# Altium schematic sheet Sheet1.SchDoc
size A3
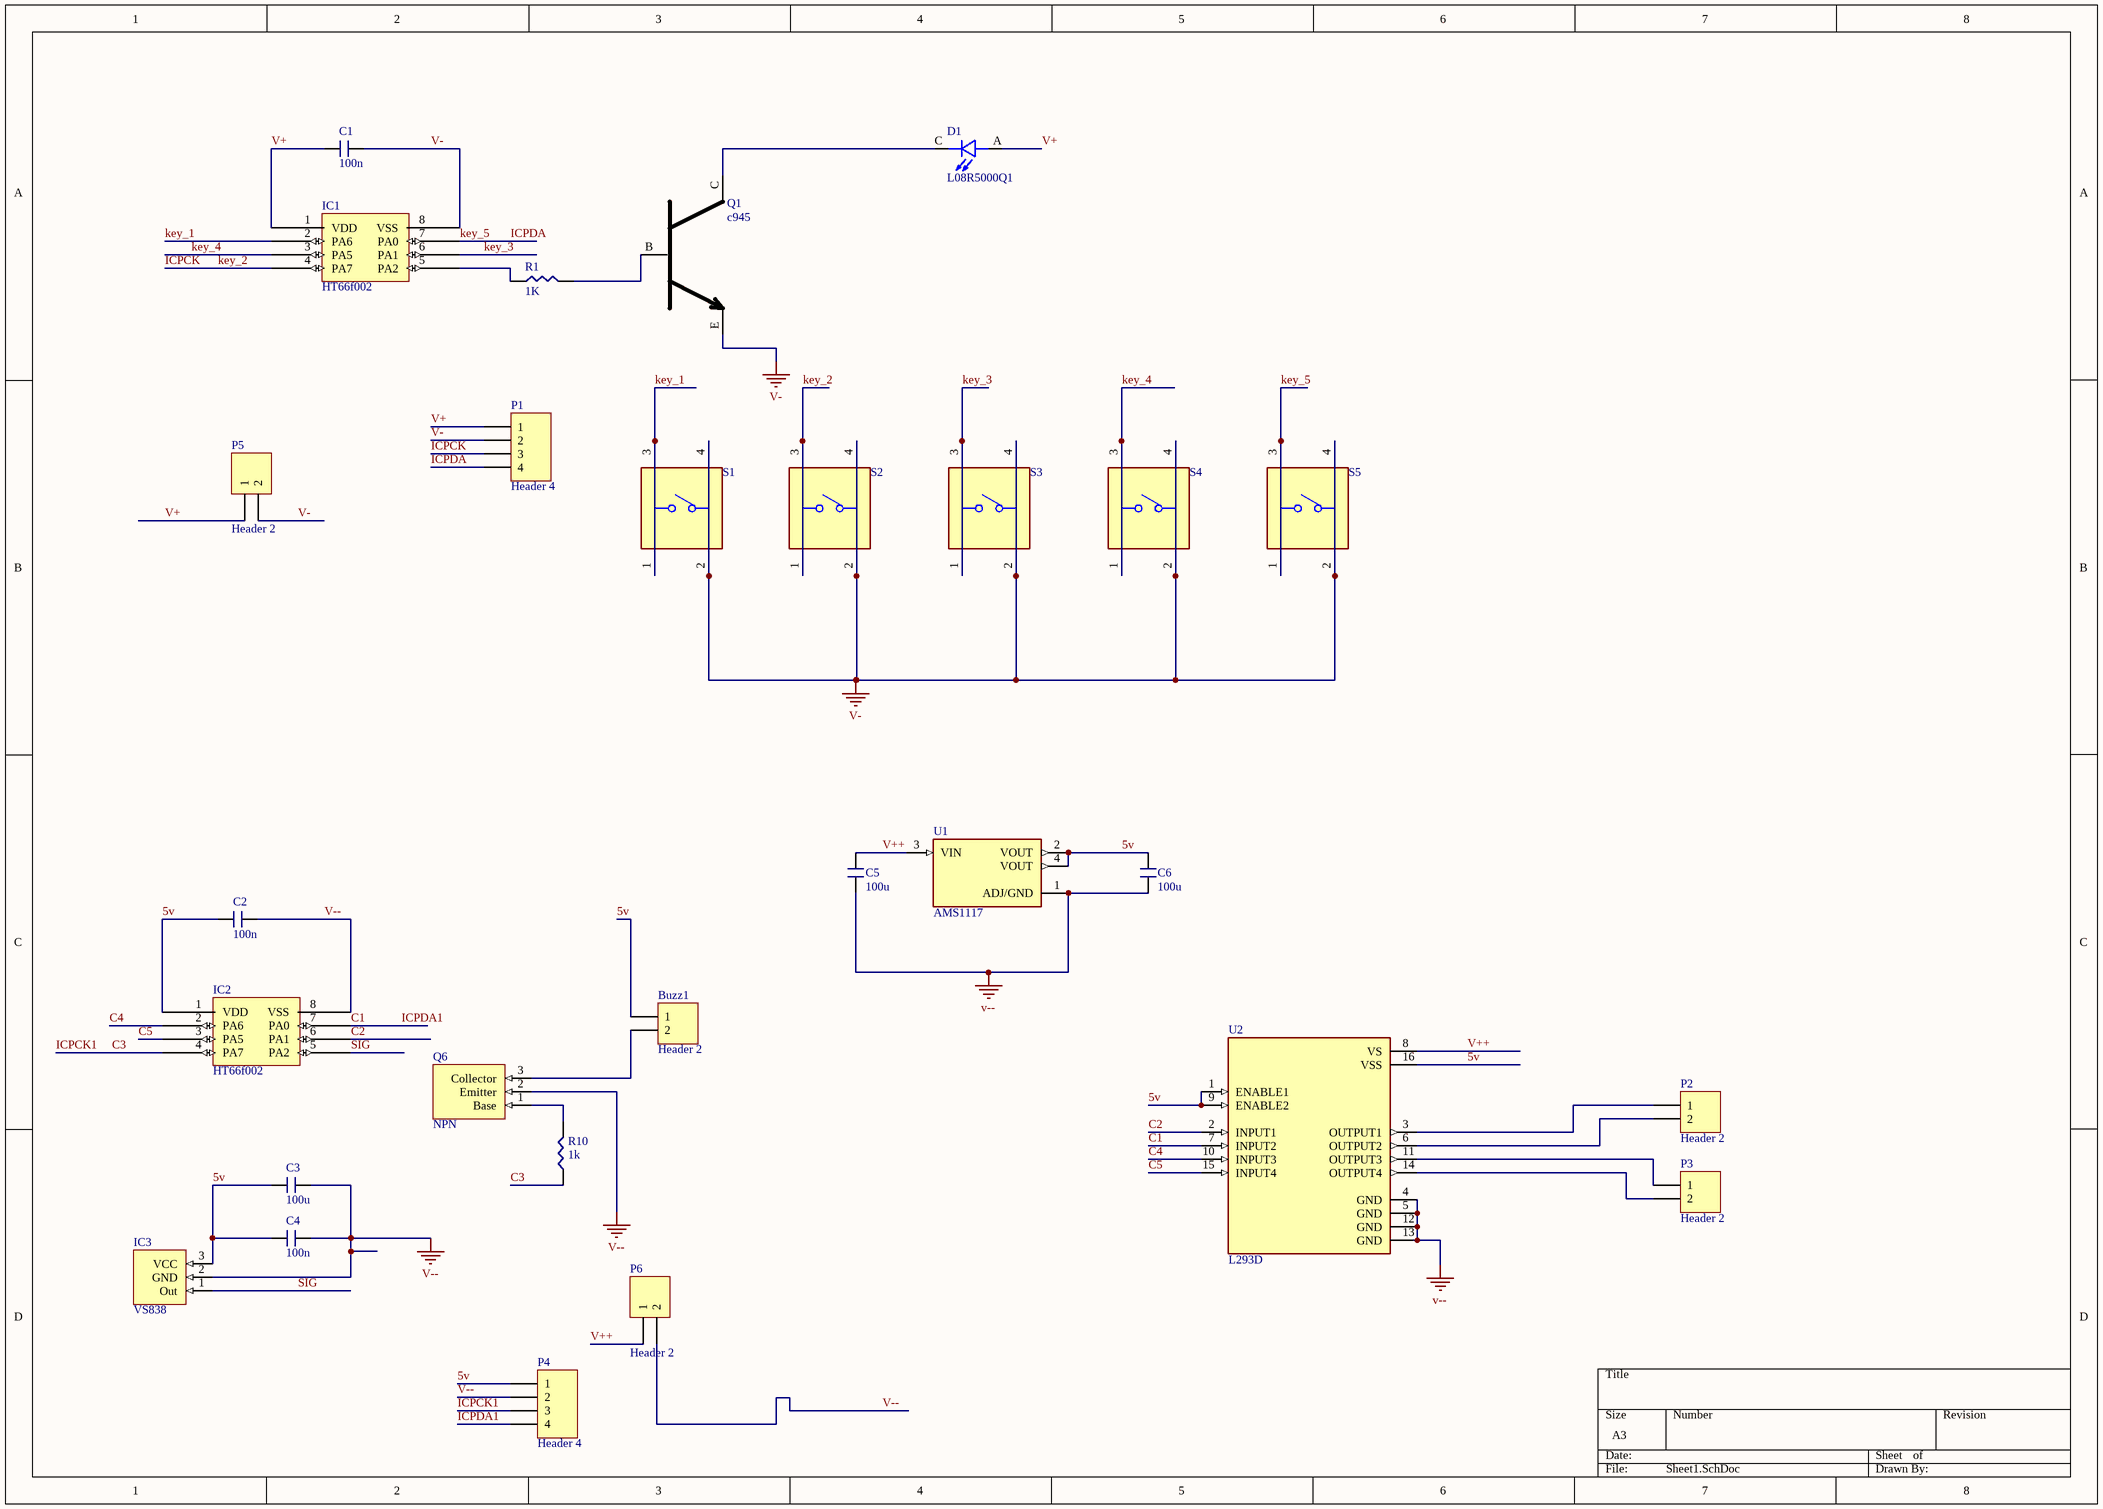
[diagram p0: Sheet1.SchDoc]

## Parts
Buzz1  Header 2  [HDR1X2]
C1  value 100n  [CAPC2012X08N-805]  (hidden comment: Capacitor)
C2  value 100n  [CAPC2012X08N-805]  (hidden comment: Capacitor)
C3  value 100u  [CAPC2012X08N-805]  (hidden comment: Capacitor)
C4  value 100n  [CAPC2012X08N-805]  (hidden comment: Capacitor)
C5  value 100u  [CAPC2012X08N-805]  (hidden comment: Capacitor)
C6  value 100u  [CAPC2012X08N-805]  (hidden comment: Capacitor)
D1  L08R5000Q1  [LEDRD254W57D500H1070]
IC1  HT66f002  [ht66f002]
IC2  HT66f002  [ht66f002]
IC3  VS838  [VS838]
P1  Header 4  [HDR1X4]
P2  Header 2  [HDR1X2]
P3  Header 2  [HDR1X2]
P4  Header 4  [HDR1X4]
P5  Header 2  [HDR1X2]
P6  Header 2  [HDR1X2]
Q1  c945  [c945]
Q6  NPN  [MMBT8050]
R1  value 1K  [RESC2012X06N-805]  (hidden comment: Resistor)
R10  value 1k  [RESC2012X06N-805]  (hidden comment: Resistor)
S1  TS04-66-95-BK-100-SMT  [SW_TS04-66-95-BK-100-SMT]  (value not drawn)
S2  TS04-66-95-BK-100-SMT  [SW_TS04-66-95-BK-100-SMT]  (value not drawn)
S3  TS04-66-95-BK-100-SMT  [SW_TS04-66-95-BK-100-SMT]  (value not drawn)
S4  TS04-66-95-BK-100-SMT  [SW_TS04-66-95-BK-100-SMT]  (value not drawn)
S5  TS04-66-95-BK-100-SMT  [SW_TS04-66-95-BK-100-SMT]  (value not drawn)
U1  AMS1117  [SOT229P700X180-4N]
U2  L293D  [DIP880W50P254L2000H510Q16]

## Nets
V-: C1.2 IC1.8(VSS) P1.2 P5.2 Q1.E S1.2 S1.4 S2.2 S2.4 S3.2 S3.4 S4.2 S4.4 S5.2 S5.4
V--: C2.2 C3.2 C4.2 C5.1 C6.1 IC2.8(VSS) IC3.2(GND) P4.2 P6.2 Q6.2(Emitter) U1.1(ADJ/GND) U2.4(GND) U2.5(GND) U2.12(GND) U2.13(GND)
5v: Buzz1.1 C2.1 C3.1 C4.1 C6.2 IC2.1(VDD) IC3.3(VCC) P4.1 U1.2(VOUT) U1.4(VOUT) U2.1(ENABLE1) U2.9(ENABLE2) U2.16(VSS)
C1: IC2.7(PA0) P4.4 U2.7(INPUT2)  [also labelled ICPDA1]
C2: IC2.6(PA1) U2.2(INPUT1)
C3: IC2.4(PA7) P4.3 R10.1  [also labelled ICPCK1]
C4: IC2.2(PA6) U2.10(INPUT3)
C5: IC2.3(PA5) U2.15(INPUT4)
ICPCK: IC1.4(PA7) P1.3 S2.1 S2.3  [also labelled key_2]
ICPDA: IC1.7(PA0) P1.4 S5.1 S5.3  [also labelled key_5]
key_1: IC1.2(PA6) S1.1 S1.3
key_3: IC1.6(PA1) S3.1 S3.3
key_4: IC1.3(PA5) S4.1 S4.3
SIG: IC2.5(PA2) IC3.1(Out)
V+: C1.1 D1.A IC1.1(VDD) P1.1 P5.1
V++: C5.2 P6.1 U1.3(VIN) U2.8(VS)
NetBuzz1_2: Buzz1.2 Q6.3(Collector)
NetD1_C: D1.C Q1.C
NetIC1_5: IC1.5(PA2) R1.1
NetP2_1: P2.1 U2.3(OUTPUT1)
NetP2_2: P2.2 U2.6(OUTPUT2)
NetP3_1: P3.1 U2.11(OUTPUT3)
NetP3_2: P3.2 U2.14(OUTPUT4)
NetQ1_B: Q1.B R1.2
NetQ6_1: Q6.1(Base) R10.2

## Library data of the parts
Buzz1 P2 P3 P5 P6 = Header 2: Header, 2-Pin; LatestRevisionDate: 17-Jul-2002; LatestRevisionNote: Re-released for DXP Platform.; Publisher: Altium Limited
C1-C6 = Capacitor: Standard Bipolar Capasitor
D1 = L08R5000Q1: LED, Orange, Through Hole, T-1 3/4 (5mm), 30 mA, 2.1 V, 635 nm; Price: None; MP: L08R5000Q1; Value: *; Availability: Unavailable; Package: None
P1 P4 = Header 4: Header, 4-Pin; LatestRevisionDate: 17-Jul-2002; LatestRevisionNote: Re-released for DXP Platform.; Publisher: Altium Limited
Q6 = MMBT8050
R1 R10 = Resistor: Standard Resistor
S1-S5 = TS04-66-95-BK-100-SMT: 6 x 6 mm, 4.3~9.5 mm Actuator Height, 100~260 gf, Surface Mount, SPST, Tactile Switch; MF: CUI Devices; Package: None; Price: None; SnapEDA_Link: https://www.snapeda.com/parts/TS04-66-95-BK-100-SMT/CUI+Devices/view-part/?ref=snap; CUI_purchase_URL: https://www.cuidevices.com/product/switches/tactile-switches/ts04-series?utm_source=snapeda.com&utm_medium=referral&utm_campaign=snapedaBOM; Value: *; Check_prices: https://www.snapeda.com/parts/TS04-66-95-BK-100-SMT/CUI+Devices/view-part/?ref=eda; MP: TS04-66-95-BK-100-SMT; Purchase-URL: https://pricing.snapeda.com/search/part/TS04-66-95-BK-100-SMT/?ref=eda; Availability: In Stock
U1 = AMS1117: 1A LOW DROPOUT VOLTAGE REGULATOR SOT-223; MF: Advanced Monolithic Systems; Price: None; Availability: Not in stock; Package: SOT-223 Seeed Technology; MP: AMS1117; Value: *; SnapEDA_Link: https://www.snapeda.com/parts/AMS1117/Advanced+Monolithic+Systems/view-part/?ref=snap; Check_prices: https://www.snapeda.com/parts/AMS1117/Advanced+Monolithic+Systems/view-part/?ref=eda
U2 = L293D: Bipolar Motor Driver - Parallel 16-PowerDIP; MF: STMicroelectronics; MP: L293D; Package: DIP-16 STMicroelectronics; SnapEDA_Link: https://www.snapeda.com/parts/L293D/STMicroelectronics/view-part/?ref=snap; Purchase-URL: https://pricing.snapeda.com/search/part/L293D/?ref=eda; Check_prices: https://www.snapeda.com/parts/L293D/STMicroelectronics/view-part/?ref=eda; Availability: In Stock; Value: *; Price: None